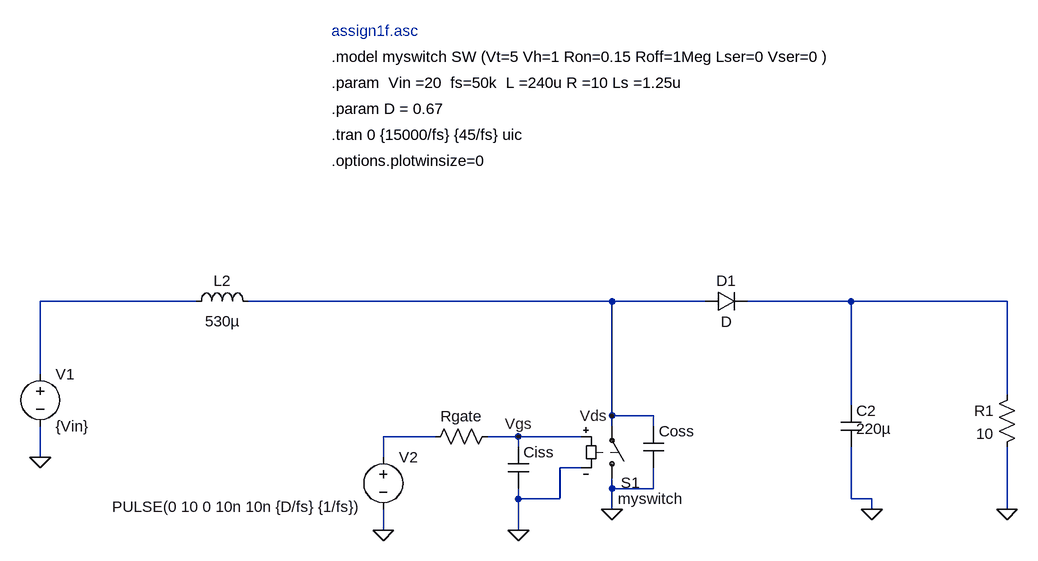
[diagram p0: schematic DCDC_converter_LTspice.asc]
DCDC_converter_LTspice.asc, the LTspice schematic file:
Version 4
SHEET 1 1188 916
WIRE -336 224 -576 224
WIRE 304 224 -256 224
WIRE 448 224 304 224
WIRE 672 224 512 224
WIRE 912 224 672 224
WIRE -576 336 -576 224
WIRE 912 368 912 224
WIRE 672 384 672 224
WIRE 304 400 304 224
WIRE 368 400 304 400
WIRE 304 416 304 400
WIRE 368 416 368 400
WIRE 32 432 -48 432
WIRE 160 432 112 432
WIRE 256 432 160 432
WIRE 160 448 160 432
WIRE -576 464 -576 416
WIRE -48 464 -48 432
WIRE 256 480 224 480
WIRE 304 512 304 496
WIRE 368 512 368 480
WIRE 368 512 304 512
WIRE 160 528 160 512
WIRE 224 528 224 480
WIRE 224 528 160 528
WIRE 672 528 672 448
WIRE 704 528 672 528
WIRE 304 544 304 512
WIRE 704 544 704 528
WIRE 912 544 912 448
WIRE -48 576 -48 544
WIRE 160 576 160 528
FLAG 160 576 0
FLAG -48 576 0
FLAG 304 544 0
FLAG -576 464 0
FLAG 160 432 Vgs
FLAG 304 400 Vds
FLAG 704 544 0
FLAG 912 544 0
SYMBOL diode 448 240 R270
WINDOW 0 32 32 VTop 2
WINDOW 3 0 32 VBottom 2
SYMATTR InstName D1
SYMBOL res 928 352 M0
SYMATTR InstName R1
SYMATTR Value 10
SYMBOL sw 304 512 M180
WINDOW 0 43 9 Right 2
WINDOW 3 108 -16 Right 2
SYMATTR InstName S1
SYMATTR Value myswitch
SYMBOL voltage -576 320 R0
SYMATTR InstName V1
SYMATTR Value {Vin}
SYMBOL voltage -48 448 R0
WINDOW 123 0 0 Left 2
WINDOW 39 0 0 Left 2
WINDOW 3 -417 92 Left 2
SYMATTR Value PULSE(0 10 0 10n 10n {D/fs} {1/fs})
SYMATTR InstName V2
SYMBOL res 128 416 R90
WINDOW 0 0 56 VBottom 2
WINDOW 3 32 56 Invisible 2
SYMATTR InstName Rgate
SYMATTR Value 10
SYMBOL cap 352 416 R0
WINDOW 3 24 56 Invisible 2
SYMATTR Value 0
SYMATTR InstName Coss
SYMBOL cap 144 448 R0
WINDOW 3 24 56 Invisible 2
SYMATTR Value 1160p
SYMATTR InstName Ciss
SYMBOL ind -240 240 M270
WINDOW 0 32 56 VTop 2
WINDOW 3 1 55 VBottom 2
SYMATTR InstName L2
SYMATTR Value 530µ
SYMATTR SpiceLine Rser=100m
SYMBOL cap 656 384 R0
WINDOW 3 24 36 Left 2
SYMATTR Value 220µ
SYMATTR InstName C2
TEXT -128 -152 Left 2 !.model myswitch SW (Vt=5 Vh=1 Ron=0.15 Roff=1Meg Lser=0 Vser=0 )
TEXT -128 -72 Left 2 !.param D = 0.67
TEXT -128 -32 Left 2 !.tran 0 {15000/fs} {45/fs} uic
TEXT -128 -112 Left 2 !.param  Vin =20  fs=50k  L =240u R =10 Ls =1.25u
TEXT -128 -192 Left 2 ;assign1f.asc
TEXT -128 8 Left 2 !.options.plotwinsize=0

The netlist it stands for:
* DCDC_converter_LTspice.asc
D1 Vds N002 D
R1 N002 0 10
S1 0 Vds Vgs 0 myswitch
V1 N001 0 {Vin}
V2 N003 0 PULSE(0 10 0 10n 10n {D/fs} {1/fs})
Rgate Vgs N003 10
Coss Vds 0 0
Ciss Vgs 0 1160p
L2 Vds N001 530µ Rser=100m
C2 N002 0 220µ
.model D D
.lib standard.dio
.model myswitch SW (Vt=5 Vh=1 Ron=0.15 Roff=1Meg Lser=0 Vser=0 )
.param D = 0.67
.tran 0 {15000/fs} {45/fs} uic
.param  Vin =20  fs=50k  L =240u R =10 Ls =1.25u
* assign1f.asc
.options.plotwinsize=0
.backanno
.end